# EasyEDA schematic SCH_Project2_2025-11-12.json

## Sheets
1 Sheet_3: TITLE: ProMicro, Temp.sensor; REV: 1.0; Date: 2025-10-28; Sheet: 1/1; Drawn By: corlov; Company: Your Company
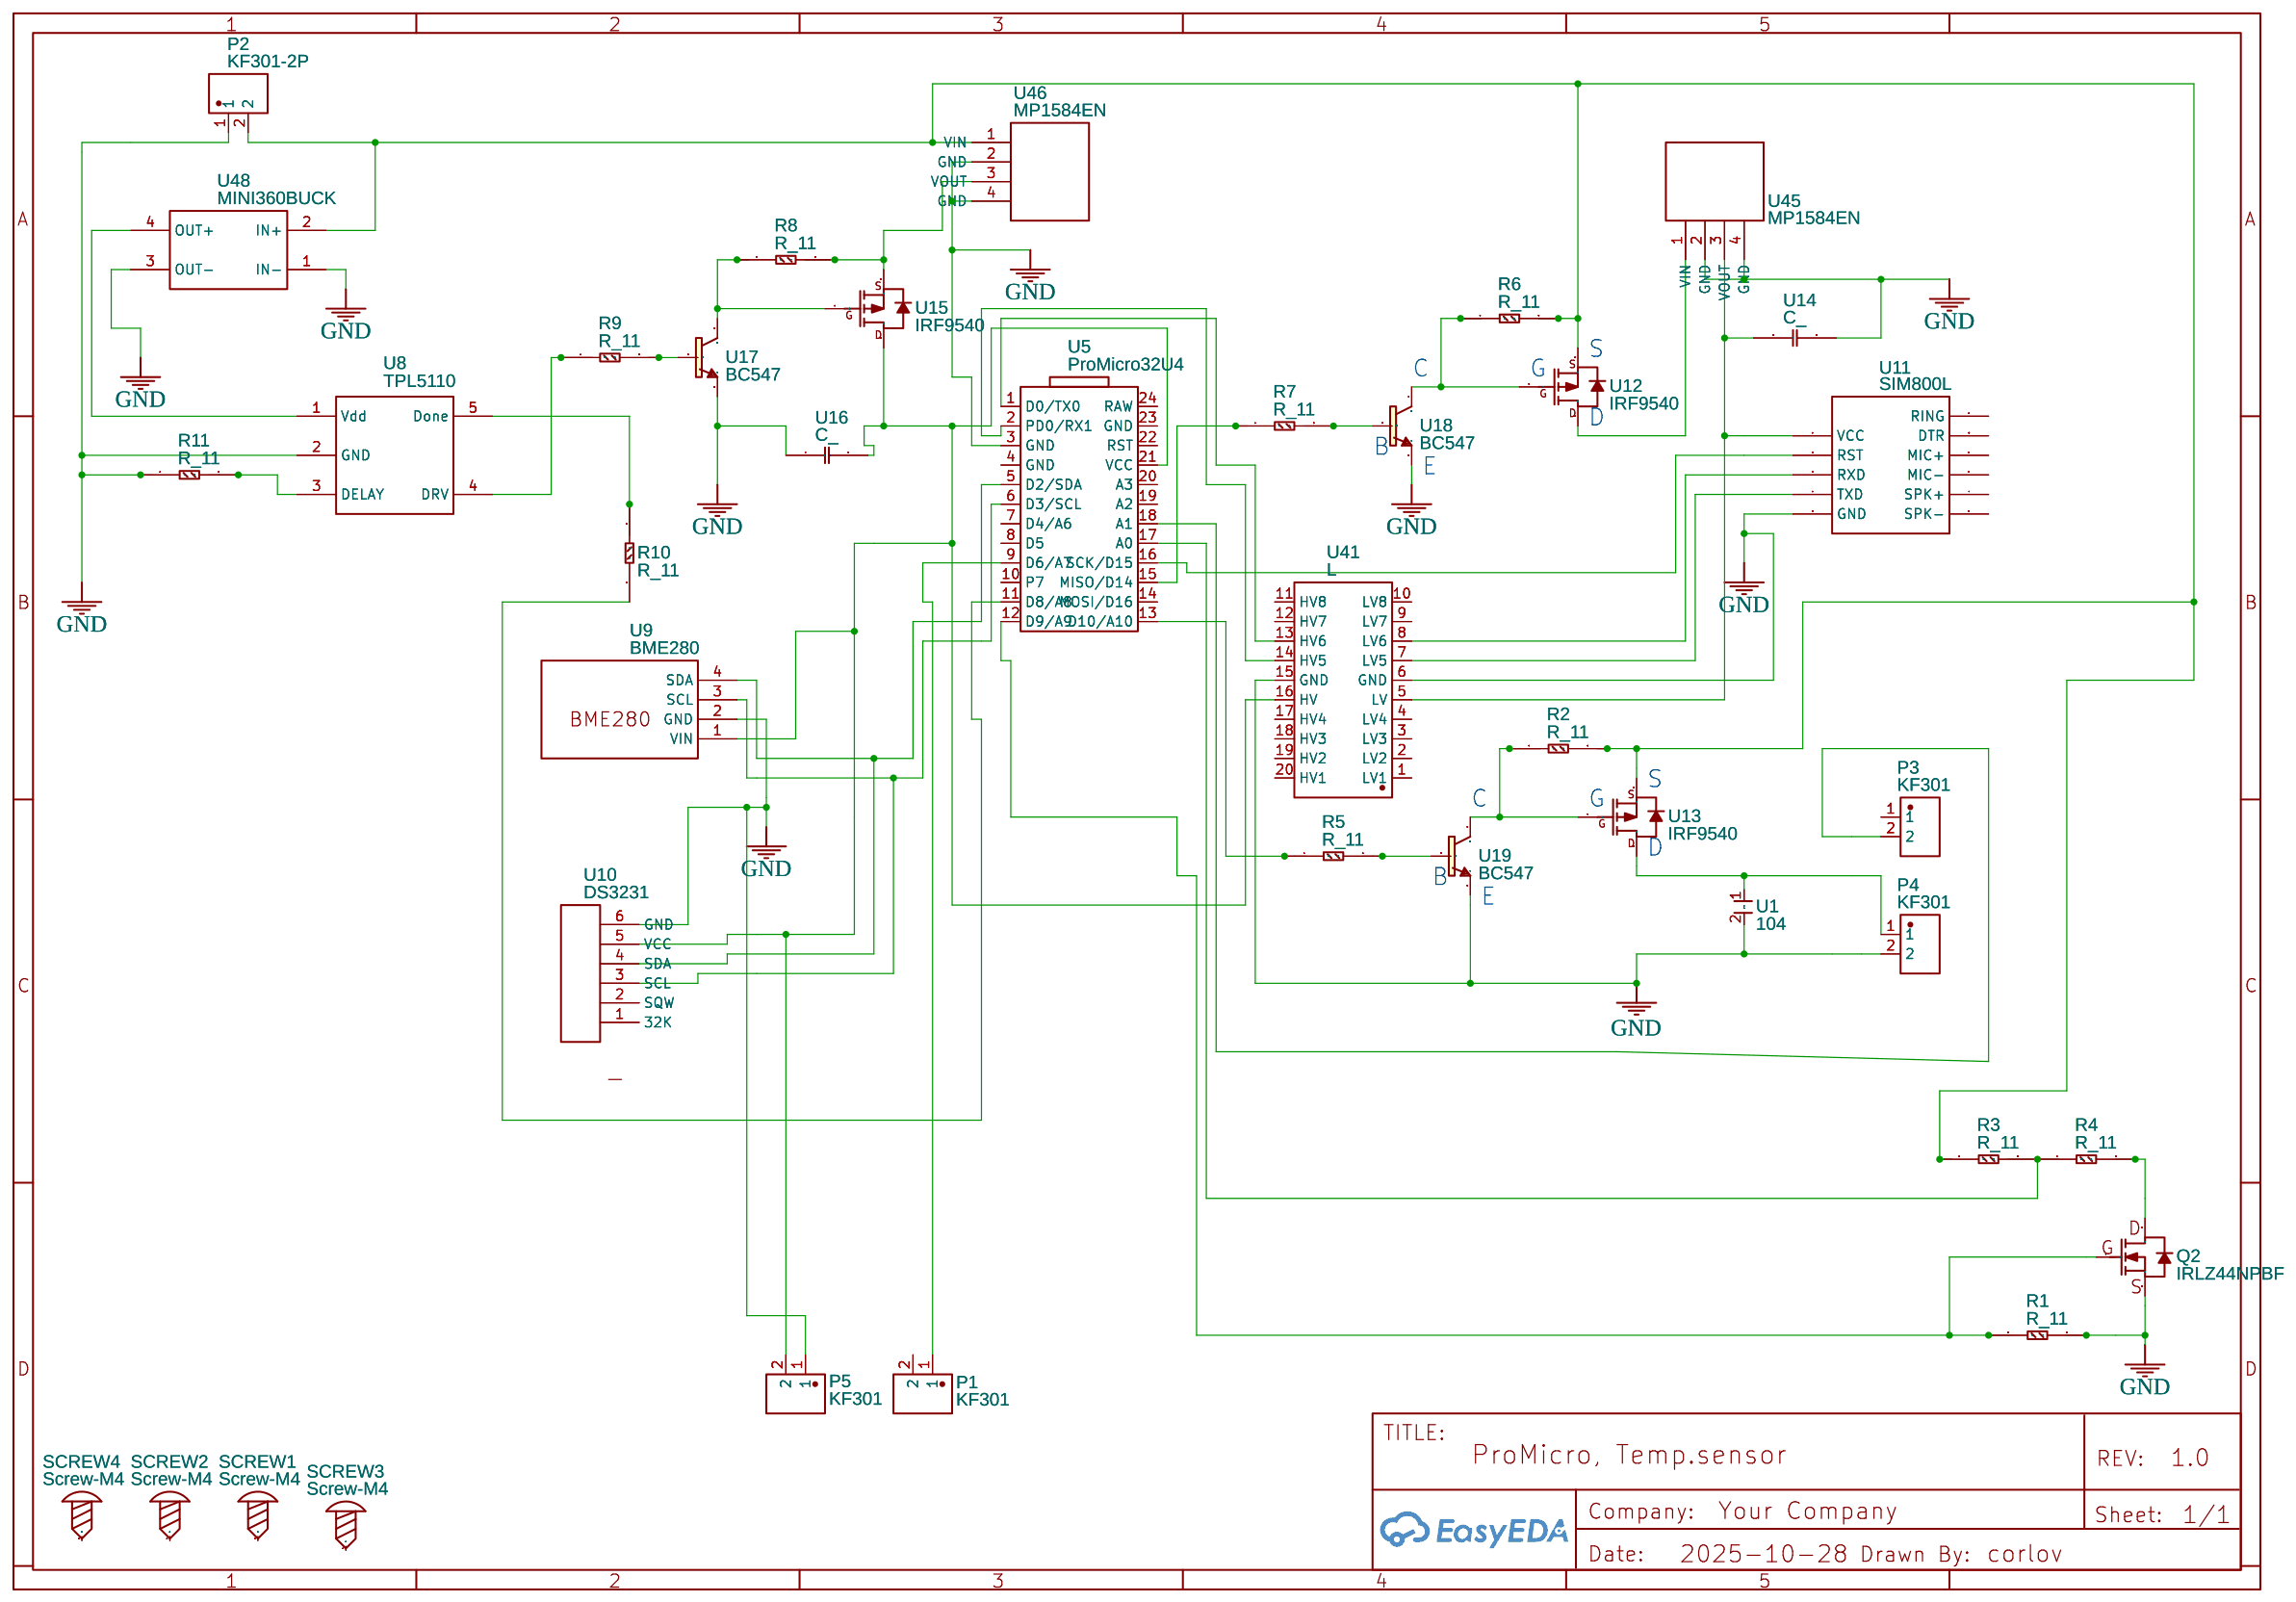
[diagram p0: Sheet_3]
2 Sheet_4
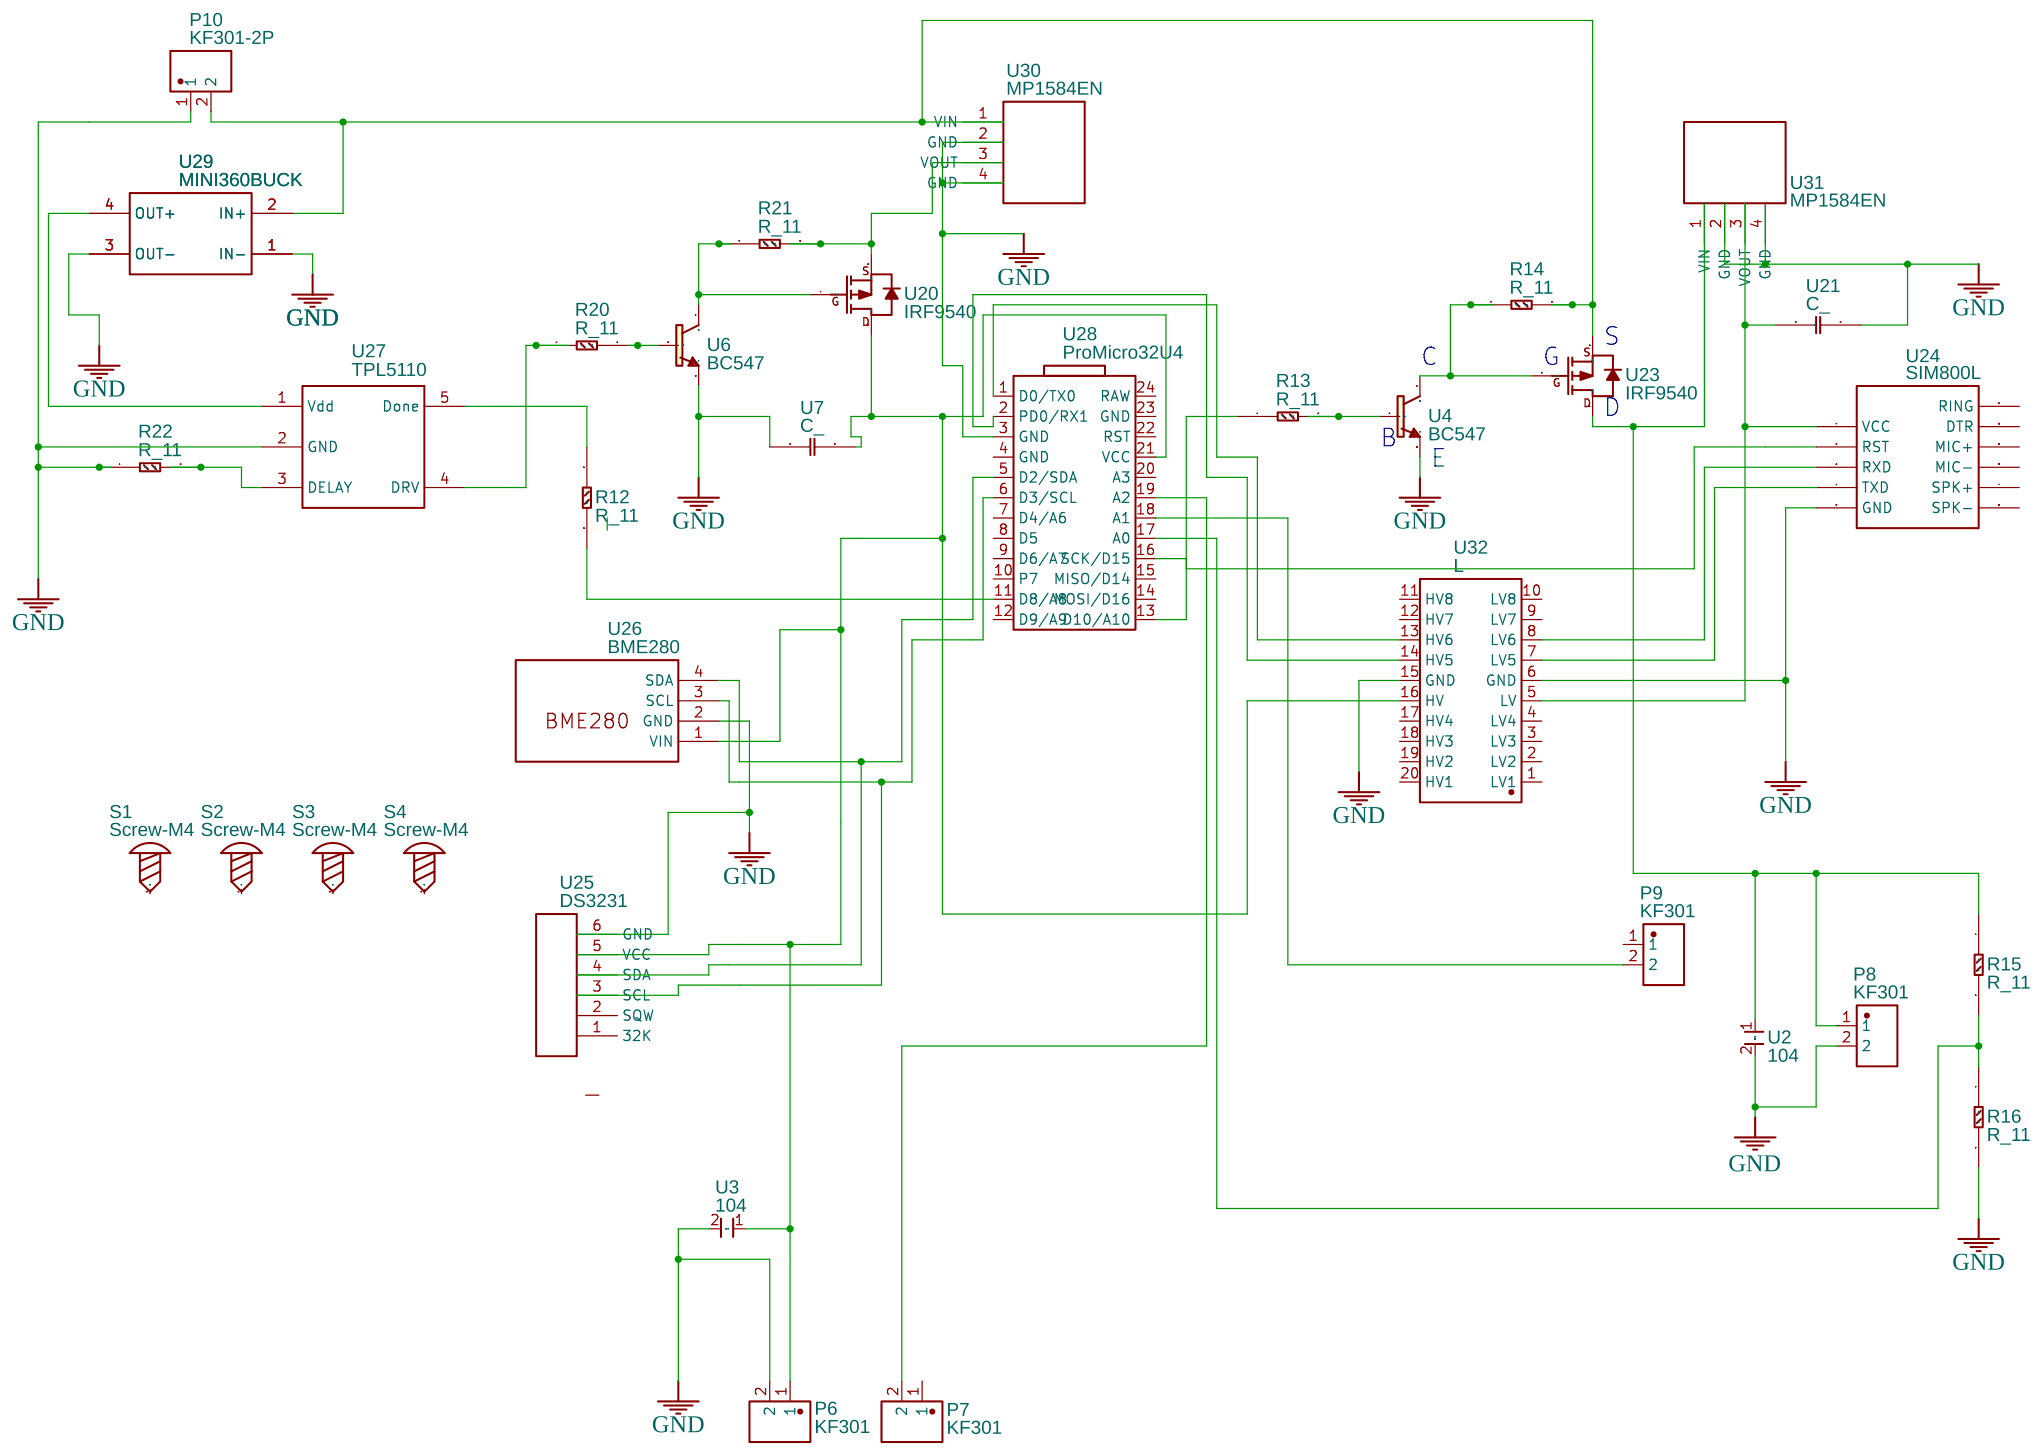
[diagram p1: Sheet_4]

## Parts
sheet Sheet_3
P1  KF301  [CONN-TH_XY301V-A-5.0-2P]
P2  KF301-2P  [CONN-TH_XY301V-A-5.0-2P]
P3  KF301  [CONN-TH_XY301V-A-5.0-2P]
P4  KF301  [CONN-TH_XY301V-A-5.0-2P]
P5  KF301  [CONN-TH_XY301V-A-5.0-2P]
Q2  IRLZ44NPBF  [TO-220-3 (IRLZ44NPBF)_L10.0-W4.5-P2.54-L]
R1  R_11  [R_0_125]
R2  R_11  [R_0_125]
R3  R_11  [R_0_125]
R4  R_11  [R_0_125]
R5  R_11  [R_0_125]
R6  R_11  [R_0_125]
R7  R_11  [R_0_125]
R8  R_11  [R_0_125]
R9  R_11  [R_0_125]
R10  R_11  [R_0_125]
R11  R_11  [R_0_125]
SCREW1  Screw-M4  [SCREW-M4]
SCREW2  Screw-M4  [SCREW-M4]
SCREW3  Screw-M4  [SCREW-M4]
SCREW4  Screw-M4  [SCREW-M4]
U1  104  [104]
U5  ProMicro32U4  [ARDUINOPROMICRO-PWB]
U8  TPL5110  [TPL5110]
U9  BME280  [BME280]
U10  DS3231  [DS3231]
U11  SIM800L  [SIM800L]
U12  IRF9540  [IRF9540]
U13  IRF9540  [IRF9540]
U14  C_  [C_]
U15  IRF9540  [IRF9540]
U16  C_  [C_]
U17  BC547  [BC547 (2)]
U18  BC547  [BC547 (2)]
U19  BC547  [BC547 (2)]
U41  L  [MPN-TH-20_L28.0-W14.0-P2.54-BL]
U45  MP1584EN  [MP1584EN]
U46  MP1584EN  [MP1584EN]
U48  MINI360BUCK  [MINI360BUCK]
sheet Sheet_4
P6  KF301  [CONN-TH_XY301V-A-5.0-2P]
P7  KF301  [CONN-TH_XY301V-A-5.0-2P]
P8  KF301  [CONN-TH_XY301V-A-5.0-2P]
P9  KF301  [CONN-TH_XY301V-A-5.0-2P]
P10  KF301-2P  [CONN-TH_XY301V-A-5.0-2P]
R12  R_11  [R_0_125]
R13  R_11  [R_0_125]
R14  R_11  [R_0_125]
R15  R_11  [R_0_125]
R16  R_11  [R_0_125]
R20  R_11  [R_0_125]
R21  R_11  [R_0_125]
R22  R_11  [R_0_125]
S1  Screw-M4  [SCREW-M4]
S2  Screw-M4  [SCREW-M4]
S3  Screw-M4  [SCREW-M4]
S4  Screw-M4  [SCREW-M4]
U2  104  [104]
U3  104  [104]
U4  BC547  [BC547 (2)]
U6  BC547  [BC547 (2)]
U7  C_  [C_]
U20  IRF9540  [IRF9540]
U21  C_  [C_]
U23  IRF9540  [IRF9540]
U24  SIM800L  [SIM800L]
U25  DS3231  [DS3231]
U26  BME280  [BME280]
U27  TPL5110  [TPL5110]
U28  ProMicro32U4  [ARDUINOPROMICRO-PWB]
U29  MINI360BUCK  [MINI360BUCK]
U30  MP1584EN  [MP1584EN]
U31  MP1584EN  [MP1584EN]
U32  L  [MPN-TH-20_L28.0-W14.0-P2.54-BL]

## Library data of the parts
P1-P10 = KF301-2P VCC Y GND: Contributor: lcsc; Supplier: LCSC; Supplier Part: C9900016950; Manufacturer: null; Manufacturer Part: KF301-2P接线端子; JLCPCB Part Class: Extended Part
Q2 = IRLZ44NPBF: Supplier: LCSC; Manufacturer: Infineon(英飞凌); Supplier Part: C38774; JLCPCB Part Class: Extended Part; Contributor: ARNABMACH0
R1-R16 R20-R22 = R_: Contributor: verdenum
S1-S4 SCREW1-SCREW4 = Screw-M4: Contributor: EasyEDA
U1-U3 = 104: Manufacturer: Fe; Contributor: Guest
U5 U28 = ProMicro32U4: Manufacturer: generic; Manufacturer Part: generic; Supplier Part: undefined; Contributor: pbinsted
U8 U27 = ADAFRUIT TPL5110 BREAKOUT: Manufacturer Part: 3435; Supplier Part: 3435; Supplier: Adafruit; link: https://learn.adafruit.com/adafruit-tpl5110-power-timer-breakout?view=all; Contributor: Sdobout
U9 U26 = BME280: Contributor: allvex
U10 U25 = DS3231 upright: Contributor: poljak1141leonardo
U11 U24 = SIM800L: Contributor: Rafa_2122
U12 U13 U15 U20 U23 = IRF9540: Contributor: alesmo
U7 U14 U16 U21 = C_: Contributor: verdenum
U4 U6 U17-U19 = BC547: Contributor: joaodahlke
U32 U41 = LEVEL CONVERTER 8: Contributor: LCSC; Supplier: LCSC; Supplier Part: C2829587; Manufacturer: null; Manufacturer Part: Level Converter 8; JLCPCB Part Class: Extended Part
U30 U31 U45 U46 = MP1584EN: Contributor: babeinlovexd
U29 U48 = MINI360BUCK: Contributor: Andrey Fedorov; sourceId: FRLFXR8qI; Manufacturer Part: Mini360; link: http://ali.pub/399f0z

## Nets
GND: P2.1 P4.2 P5.1 P6.2 P8.2 P10.1 Q2.3(S) R1.2 R11.1 R16.2 R22.1 U1.2 U2.2 U3.2 U4.3(E) U5.3(GND) U6.3(E) U7.1 U8.2(GND) U9.2(GND) U10.6(GND) U11.5(GND) U14.2 U16.1 U17.3(E) U18.3(E) U19.3(E) U21.2 U24.5(GND) U25.6(GND) U26.2(GND) U27.2(GND) U28.3(GND) U29.1(IN-) U29.3(OUT-) U30.2(GND) U30.4(GND) U31.2(GND) U31.4(GND) U32.6(GND) U32.15(GND) U41.6(GND) U41.15(GND) U45.2(GND) U45.4(GND) U46.2(GND) U46.4(GND) U48.1(IN-) U48.3(OUT-)
Net-(P1-1): P1.1 U5.9(D6/A7)
Net-(P2-2): P2.2 R2.2 R3.1 R6.2 U12.3(S) U13.3(S) U46.1(VIN) U48.2(IN+)
Net-(P3-2): P3.2 U5.18(A1)
Net-(P4-1): P4.1 U1.1 U13.2(D)
Net-(P5-2): P5.2 U5.21(VCC) U9.1(VIN) U10.5(VCC) U15.2(D) U16.2 U41.16(HV)
Net-(P6-1): P6.1 U3.1 U7.2 U20.2(D) U25.5(VCC) U26.1(VIN) U28.21(VCC) U32.16(HV)
Net-(P7-2): P7.2 U28.19(A2)
Net-(P8-1): P8.1 R15.1 U2.1 U23.2(D) U31.1(VIN)
Net-(P9-2): P9.2 U28.18(A1)
Net-(P10-2): P10.2 R14.2 U23.3(S) U29.2(IN+) U30.1(VIN)
Net-(Q2-1): Q2.1(G) R1.1 U5.12(D9/A9)
Net-(Q2-2): Q2.2(D) R4.2
Net-(R2-1): R2.1 U13.1(G) U19.1(C)
Net-(R3-2): R3.2 R4.1 U5.17(A0)
Net-(R5-1): R5.1 U5.13(D10/A10)
Net-(R5-2): R5.2 U19.2(B)
Net-(R6-1): R6.1 U12.1(G) U18.1(C)
Net-(R7-1): R7.1 U5.15(MISO/D14)
Net-(R7-2): R7.2 U18.2(B)
Net-(R8-1): R8.1 U15.1(G) U17.1(C)
Net-(R8-2): R8.2 U15.3(S) U46.3(VOUT)
Net-(R9-1): R9.1 U8.4(DRV)
Net-(R9-2): R9.2 U17.2(B)
Net-(R10-1): R10.1 U8.5(Done)
Net-(R10-2): R10.2 U5.11(D8/A8)
Net-(R11-2): R11.2 U8.3(DELAY)
Net-(R12-1): R12.1 U27.5(Done)
Net-(R12-2): R12.2 U28.11(D8/A8)
Net-(R13-1): R13.1 U28.13(D10/A10)
Net-(R13-2): R13.2 U4.2(B)
Net-(R14-1): R14.1 U4.1(C) U23.1(G)
Net-(R15-2): R15.2 R16.1 U28.17(A0)
Net-(R20-1): R20.1 U27.4(DRV)
Net-(R20-2): R20.2 U6.2(B)
Net-(R21-1): R21.1 U6.1(C) U20.1(G)
Net-(R21-2): R21.2 U20.3(S) U30.3(VOUT)
Net-(R22-2): R22.2 U27.3(DELAY)
Net-(U5-1): U5.1(D0/TX0) U41.13(HV6)
Net-(U5-2): U5.2(PD0/RX1) U41.14(HV5)
Net-(U5-5): U5.5(D2/SDA) U9.4(SDA) U10.4(SDA)
Net-(U5-6): U5.6(D3/SCL) U9.3(SCL) U10.3(SCL)
Net-(U5-16): U5.16(SCK/D15) U11.2(RST)
Net-(U8-1): U8.1(Vdd) U48.4(OUT+)
Net-(U11-1): U11.1(VCC) U14.1 U41.5(LV) U45.3(VOUT)
Net-(U11-3): U11.3(RXD) U41.8(LV6)
Net-(U11-4): U11.4(TXD) U41.7(LV5)
Net-(U12-2): U12.2(D) U45.1(VIN)
Net-(U21-1): U21.1 U24.1(VCC) U31.3(VOUT) U32.5(LV)
Net-(U24-2): U24.2(RST) U28.16(SCK/D15)
Net-(U24-3): U24.3(RXD) U32.8(LV6)
Net-(U24-4): U24.4(TXD) U32.7(LV5)
Net-(U25-3): U25.3(SCL) U26.3(SCL) U28.6(D3/SCL)
Net-(U25-4): U25.4(SDA) U26.4(SDA) U28.5(D2/SDA)
Net-(U27-1): U27.1(Vdd) U29.4(OUT+)
Net-(U28-1): U28.1(D0/TX0) U32.13(HV6)
Net-(U28-2): U28.2(PD0/RX1) U32.14(HV5)

Not connected (* = marked no-connect by the designer): P1 2; P3 1; P7 1; P9 1; S1 1; S2 1; S3 1; S4 1; SCREW1 1; SCREW2 1; SCREW3 1; SCREW4 1; U5 4(GND) 7(D4/A6) 8(D5) 10(P7) 14(MOSI/D16) 19(A2) 20(A3) 22(RST) 23(GND) 24(RAW); U10 1(32K) 2(SQW); U11 6(SPK-) 7(SPK+) 8(MIC-) 9(MIC+) 10(DTR) 11(RING); U24 6(SPK-) 7(SPK+) 8(MIC-) 9(MIC+) 10(DTR) 11(RING); U25 1(32K) 2(SQW); U28 4(GND) 7(D4/A6) 8(D5) 9(D6/A7) 10(P7) 12(D9/A9) 14(MOSI/D16) 15(MISO/D14) 20(A3) 22(RST) 23(GND) 24(RAW); U32 1(LV1) 2(LV2) 3(LV3) 4(LV4) 9(LV7) 10(LV8) 11(HV8) 12(HV7) 17(HV4) 18(HV3) 19(HV2) 20(HV1); U41 1(LV1) 2(LV2) 3(LV3) 4(LV4) 9(LV7) 10(LV8) 11(HV8) 12(HV7) 17(HV4) 18(HV3) 19(HV2) 20(HV1)

## Notes on the sheets
sheet 1
- S
- C
- G
- D
- B
- E
- S
- C
- G
- D
- B
- E
sheet 2
- C
- G
- S
- D
- B
- E
